# Altium schematic sheet Sheet1.SchDoc
size A
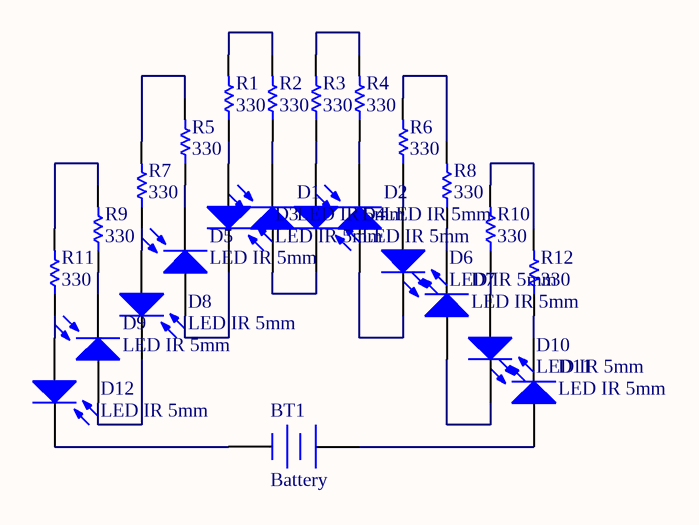
[diagram p0: Sheet1.SchDoc]

## Parts
BT1  Battery  [BAT-2]
D1  LED IR 5mm  [LED-1]
D2  LED IR 5mm  [LED-1]
D3  LED IR 5mm  [LED-1]
D4  LED IR 5mm  [LED-1]
D5  LED IR 5mm  [LED-1]
D6  LED IR 5mm  [LED-1]
D7  LED IR 5mm  [LED-1]
D8  LED IR 5mm  [LED-1]
D9  LED IR 5mm  [LED-1]
D10  LED IR 5mm  [LED-1]
D11  LED IR 5mm  [LED-1]
D12  LED IR 5mm  [LED-1]
R1  value 330  [Res50]  (hidden comment: Resistor vertical)
R2  value 330  [Res50]  (hidden comment: Resistor vertical)
R3  value 330  [Res50]  (hidden comment: Resistor vertical)
R4  value 330  [Res50]  (hidden comment: Resistor vertical)
R5  value 330  [Res50]  (hidden comment: Resistor vertical)
R6  value 330  [Res50]  (hidden comment: Resistor vertical)
R7  value 330  [Res50]  (hidden comment: Resistor vertical)
R8  value 330  [Res50]  (hidden comment: Resistor vertical)
R9  value 330  [Res50]  (hidden comment: Resistor vertical)
R10  value 330  [Res50]  (hidden comment: Resistor vertical)
R11  value 330  [Res50]  (hidden comment: Resistor vertical)
R12  value 330  [Res50]  (hidden comment: Resistor vertical)

## Nets
NetBT1_1: BT1.1(+) D11.1(A)
NetBT1_2: BT1.2(-) D12.2(K)
NetD1_1: D1.1(A) D4.2(K)
NetD1_2: D1.2(K) R2.1
NetD2_1: D2.1(A) D6.2(K)
NetD2_2: D2.2(K) R4.1
NetD3_1: D3.1(A) R1.1
NetD3_2: D3.2(K) D5.1(A)
NetD4_1: D4.1(A) R3.1
NetD5_2: D5.2(K) R5.1
NetD6_1: D6.1(A) R6.1
NetD7_1: D7.1(A) D10.2(K)
NetD7_2: D7.2(K) R8.1
NetD8_1: D8.1(A) R7.1
NetD8_2: D8.2(K) D9.1(A)
NetD9_2: D9.2(K) R9.1
NetD10_1: D10.1(A) R10.1
NetD11_2: D11.2(K) R12.1
NetD12_1: D12.1(A) R11.1
NetR1_2: R1.2 R2.2
NetR3_2: R3.2 R4.2
NetR5_2: R5.2 R7.2
NetR6_2: R6.2 R8.2
NetR9_2: R9.2 R11.2
NetR10_2: R10.2 R12.2

## Library data of the parts
BT1 = Battery: Multicell Battery; Published: 24-Mar-1999; LatestRevisionDate: 17-Jul-2002; LatestRevisionNote: Re-released for DXP Platform.; PackageReference: BAT-2; Publisher: Altium Limited; PackageDescription: Battery; 2 Leads
D1-D12 = LED IR 5mm: Typical LED; Designer: Seyed Mohsen Ghasemian; Published: 07/31/2012; PackageReference: LED; Publisher: www.picpars.com; PackageDescription: LED; 2 Leads
R1-R12 = Resistor vertical: Resistor 0.5; Publisher: Seyed mohsen ghasemian; WEB: www.picpars.com